# EAGLE design eeZeeProp (EAGLE 6.3)
DATABASE: ./../../../eagle/PARTSDB.txt
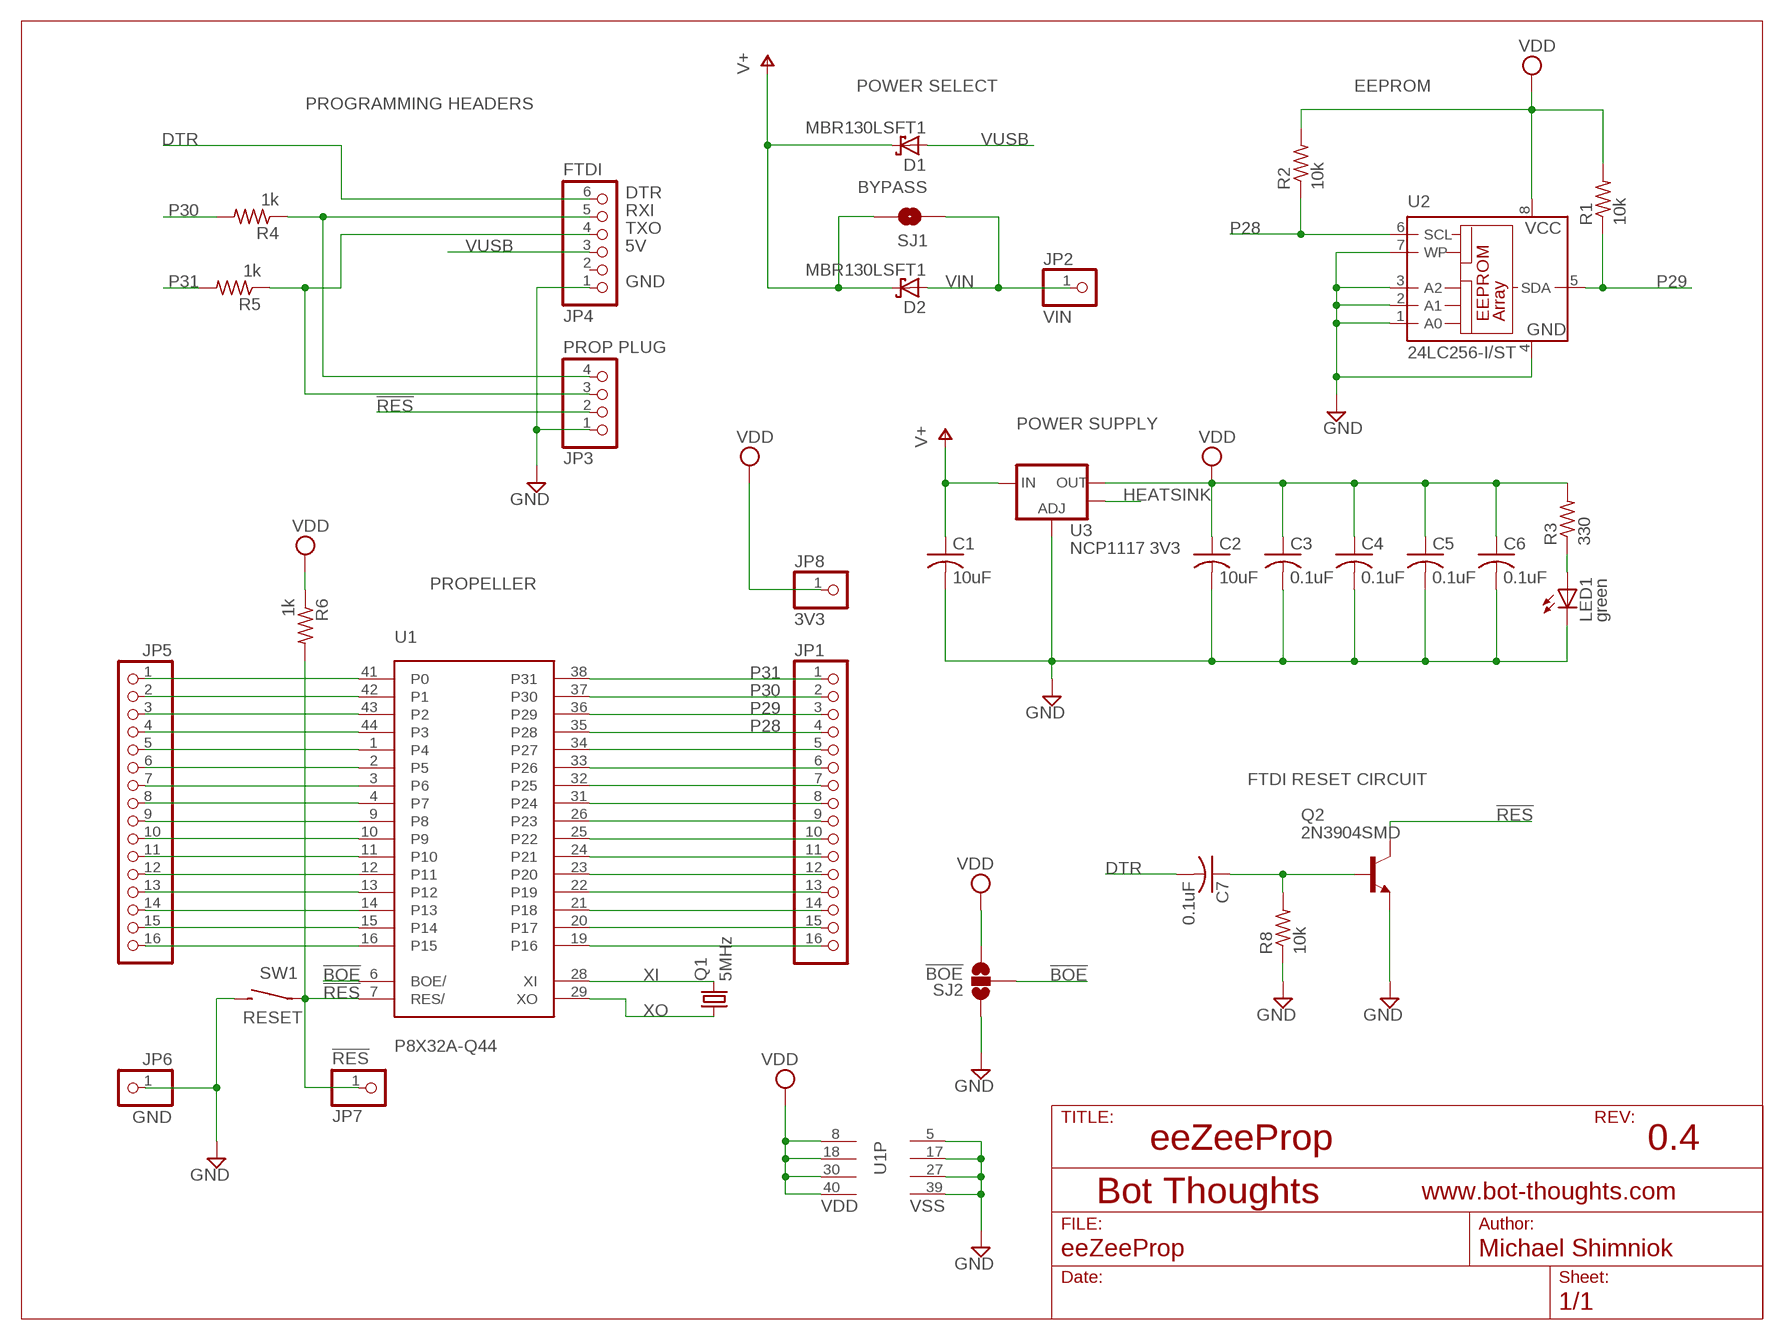
[diagram p0: schematic, sheet 1]

## Parts
C1  10uF  C-USC1206  [C1206]
C2  10uF  C-USC1206  [C1206]
C3  0.1uF  C-USC0603  [C0603]
C4  0.1uF  C-USC0603  [C0603]
C5  0.1uF  C-USC0603  [C0603]
C6  0.1uF  C-USC0603  [C0603]
C7  0.1uF  C-USC0603  [C0603]
D1  MBR130LSFT1  SCHOTTKY-DIODE-MBR130LSFT1  [SOD123FL]
D2  MBR130LSFT1  SCHOTTKY-DIODE-MBR130LSFT1  [SOD123FL]
JP1  PINHD-1X16_2.54-S  [1X16-S]
JP2  VIN  PINHD-1X01_2.54  [1X01]
JP3  PROP PLUG  PINHD-1X04_2.54-S  [1X04-S]
JP4  FTDI  PINHD-1X06_2.54-S  [1X06-S]
JP5  PINHD-1X16_2.54-S  [1X16-S]
JP6  GND  PINHD-1X01_2.54  [1X01]
JP7  !RES  PINHD-1X01_2.54  [1X01]
JP8  3V3  PINHD-1X01_2.54  [1X01]
LED1  green  LEDCHIPLED_1206  [CHIPLED_1206]
Q1  5MHz  CRYSTALHC49U-V  [HC49U-V]
Q2  2N3904SMD  [SOT-23]
R1  10k  R-US_R0603  [R0603]
R2  10k  R-US_R0603  [R0603]
R3  330  R-US_R0603  [R0603]
R4  1k  R-US_R0603  [R0603]
R5  1k  R-US_R0603  [R0603]
R6  1k  R-US_R0603  [R0603]
R8  10k  R-US_R0603  [R0603]
SJ1  BYPASS  SOLDERJUMPERNO  [SJ_2S-NO]
SJ2  !BOE  SOLDERJUMPER_2WAYS  [SJ_3]
SW1  RESET  SPST_TAC_RECT1  [6MMTACTILE_RECT]
U1  P8X32A-Q44  [P8X32A-Q44]
U2  24LC256-I/ST  24LC128SN  [SO-08]
U3  NCP1117 3V3  V_REG_LM1117SOT223  [SOT223]

## Nets
!BOE: SJ2.2 U1.6(BOE/)
!RES: JP3.2 JP7.1 Q2.1(C) R6.2 SW1.P$1(P) U1.7(RES/)
DTR: C7.2 JP4.6
GND: C1.2 C2.2 C3.2 C4.2 C5.2 C6.2 JP3.1 JP4.1 JP6.1 LED1.C Q2.2(E) R8.1 SJ2.1 SW1.P$2(S) U1.5(VSS) U1.17(VSS) U1.27(VSS) U1.39(VSS) U2.1(A0) U2.2(A1) U2.3(A2) U2.4(GND) U2.7(WP) U3.1(ADJ)
HEATSINK: U3.4(OUT)
N$1: JP5.1 U1.41(P0)
N$2: JP5.2 U1.42(P1)
N$3: JP5.3 U1.43(P2)
N$4: JP5.4 U1.44(P3)
N$5: LED1.A R3.1
N$6: JP5.5 U1.1(P4)
N$8: JP5.6 U1.2(P5)
N$9: JP5.7 U1.3(P6)
N$10: JP5.8 U1.4(P7)
N$11: JP5.9 U1.9(P8)
N$12: JP5.10 U1.10(P9)
N$13: JP5.11 U1.11(P10)
N$14: JP5.12 U1.12(P11)
N$15: JP5.13 U1.13(P12)
N$16: JP5.14 U1.14(P13)
N$17: JP5.15 U1.15(P14)
N$18: JP5.16 U1.16(P15)
N$19: JP1.5 U1.34(P27)
N$20: JP1.6 U1.33(P26)
N$21: JP1.7 U1.32(P25)
N$22: JP1.8 U1.31(P24)
N$23: JP1.9 U1.26(P23)
N$24: JP1.10 U1.25(P22)
N$25: JP1.11 U1.24(P21)
N$26: JP1.12 U1.23(P20)
N$27: JP1.13 U1.22(P19)
N$28: JP1.14 U1.21(P18)
N$29: JP1.15 U1.20(P17)
N$30: JP1.16 U1.19(P16)
N$31: C7.1 Q2.3(B) R8.2
N$34: JP3.4 JP4.5 R4.1
N$35: JP3.3 JP4.4 R5.1
P28: JP1.4 R2.1 U1.35(P28) U2.6(SCL)
P29: JP1.3 R1.1 U1.36(P29) U2.5(SDA)
P30: JP1.2 R4.2 U1.37(P30)
P31: JP1.1 R5.2 U1.38(P31)
V+: C1.1 D1.C D2.C SJ1.2 U3.3(IN)
VDD: C2.1 C3.1 C4.1 C5.1 C6.1 JP8.1 R1.2 R2.2 R3.2 R6.1 SJ2.3 U1.8(VDD) U1.18(VDD) U1.30(VDD) U1.40(VDD) U2.8(VCC) U3.2(OUT)
VIN: D2.A JP2.1 SJ1.1
VUSB: D1.A JP4.3
XI: Q1.2 U1.28(XI)
XO: Q1.1 U1.29(XO)
Unconnected: JP4.2

## Notes on the sheet
- POWER SELECT | EEPROM
- PROGRAMMING HEADERS
- DTR
- RXI
- TXO
- 5V
- GND
- POWER SUPPLY
- PROPELLER
- FTDI RESET CIRCUIT
- !BOE
- eeZeeProp | 0.4

## Library data of the parts
C1 C2 = rcl:C-US: CAPACITOR, American symbol; PARTNO: T491A106M006AT; SIZE: (0603); TC: X5R; TOL: 20%; TYPE: CER; VOLT: 10V
C3-C6 = rcl:C-US: CAPACITOR, American symbol; PARTNO: 0603YC104KAT2A; SIZE: (0603); TC: X5R; TOL: 20%; TYPE: CER; VOLT: 10V
C7 = rcl:C-US: CAPACITOR, American symbol; PARTNO: 0603YC104KAT2A
D1 D2 = mes_diode:SCHOTTKY-DIODE: DIODE transient-voltage suppressor; PARTNO: MBR130LSFT1G
JP1 JP5 = pinhead-2:PINHD-1X16: PIN HEADER
JP2 JP6-JP8 = pinhead-2:PINHD-1X01: PIN HEADER
JP3 = pinhead-2:PINHD-1X04: PIN HEADER
JP4 = pinhead-2:PINHD-1X06: PIN HEADER; PARTNO: 2211S-06G
LED1 = led:LED: LED OSRAM: - CHIPLED LG R971, LG N971, LY N971, LG Q971, LY Q971, LO R971, LY R971 LH N974, LH R974 LS Q976, LO Q976, LY Q976 LO Q996 - Hyper CHIPLED LW Q18S LB Q993, LB Q99A, LB R99A - SideLED LS A670, LO A670, LY A670, LG A670, LP A670 LB A673, LV A673, LT A673, LW A673 LH A674 LY A675 LS A676, LA A676, LO A676, LY A676, LW A676 LS A679, LY A679, LG A679 - Hyper Micro SIDELED® LS Y876, LA Y876, LO Y876, LY Y876 LT Y87S - SmartLED LW L88C, LW L88S LB L89C, LB L89S, LG L890 LS L89K, LO L89K, LY L89K LS L896, LA L896, LO L896, LY L896 - TOPLED LS T670, LO T670, LY T670, LG T670, LP T670 LSG T670, LSP T670, LSY T670, LOP T670, LYG T670 LG T671, LOG T671, LSG T671 LB T673, LV T673, LT T673, LW T673 LH T674 LS T676, LA T676, LO T676, LY T676, LB T676, LH T676, LSB T676, LW T676 LB T67C, LV T67C, LT T67C, LS T67K, LO T67K, LY T67K, LW E67C LS E67B, LA E67B, LO E67B, LY E67B, LB E67C, LV E67C, LT E67C LW T67C LS T679, LY T679, LG T679 LS T770, LO T770, LY T770, LG T770, LP T770 LB T773, LV T773, LT T773, LW T773 LH T774 LS E675, LA E675, LY E675, LS T675 LS T776, LA T776, LO T776, LY T776, LB T776 LHGB T686 LT T68C, LB T68C - Hyper Mini TOPLED® LB M676 - Mini TOPLED Santana® LG M470 LS M47K, LO M47K, LY M47K Source: http://www.osram.convergy.de LUXEON: - LUMILED® LXK2-PW12-R00, LXK2-PW12-S00, LXK2-PW14-U00, LXK2-PW14-V00 LXK2-PM12-R00, LXK2-PM12-S00, LXK2-PM14-U00 LXK2-PE12-Q00, LXK2-PE12-R00, LXK2-PE12-S00, LXK2-PE14-T00, LXK2-PE14-U00 LXK2-PB12-K00, LXK2-PB12-L00, LXK2-PB12-M00, LXK2-PB14-N00, LXK2-PB14-P00, LXK2-PB14-Q00 LXK2-PR12-L00, LXK2-PR12-M00, LXK2-PR14-Q00, LXK2-PR14-R00 LXK2-PD12-Q00, LXK2-PD12-R00, LXK2-PD12-S00 LXK2-PH12-R00, LXK2-PH12-S00 LXK2-PL12-P00, LXK2-PL12-Q00, LXK2-PL12-R00 Source: www.luxeon.com KINGBRIGHT: KA-3528ASYC Source: www.kingbright.com; PARTNO: LG N971-KN-1
Q1 = crystal:CRYSTAL: CRYSTAL; OC_FARNELL: 1666969; OC_NEWARK: unknown; PARTNO: HC49US-5.000MABJ-UB
Q2 = mes_transistors:2N3904: NPN Transistor Small signal NPN Bipolar Junction Transistor (BJT). Use this device to represent any of a number of such transistors with similar package and pinout: 2N4401, 2N3904, 2N2222, etc.; PARTNO: MMBT3904LT3G
R1 R2 R8 = rcl:R-US_: RESISTOR, American symbol; PARTNO: ERJ-3GEYJ103V; RATE: 100mW; SIZE: (0603); TOL: 5%
R3 = rcl:R-US_: RESISTOR, American symbol; PARTNO: ERJ-3GEYJ331V
R4-R6 = rcl:R-US_: RESISTOR, American symbol; PARTNO: RC0603JR-071KL; RATE: 100mW; SIZE: (0603); TOL: 5%
SJ1 = SparkFun:SOLDERJUMPER: Solder Jumper Standard SMD solder jumper. Used to automate production. Two varients : Normally Open and Normally Closed are the same, but have different paste layers. NC will have a large amount of paste and should jumper during reflow.
SJ2 = SparkFun:SOLDERJUMPER_2WAY: Solder Jumper 2 way solder jumper
SW1 = mes_electromech:SPST: SPST SWITCH; PARTNO: MJTP1243
U1 = parallax_propeller:P8X32A-Q44; PARTNO: P8X32A-Q44
U2 = microchip:24*: Serial EEPROM I2C; MF: OnSemi; MPN: CAT24C256WI-GT3; OC_FARNELL: 9757937; OC_NEWARK: 30H1511; PARTNO: CAT24C256WI-GT3
U3 = SparkFun:V_REG_LM1117: Voltage Regulator LM1117 Standard adjustable voltage regulator but in SMD form. Spark Fun Electronics SKU : COM-00595; PARTNO: NCP1117ST33T3G

## Board
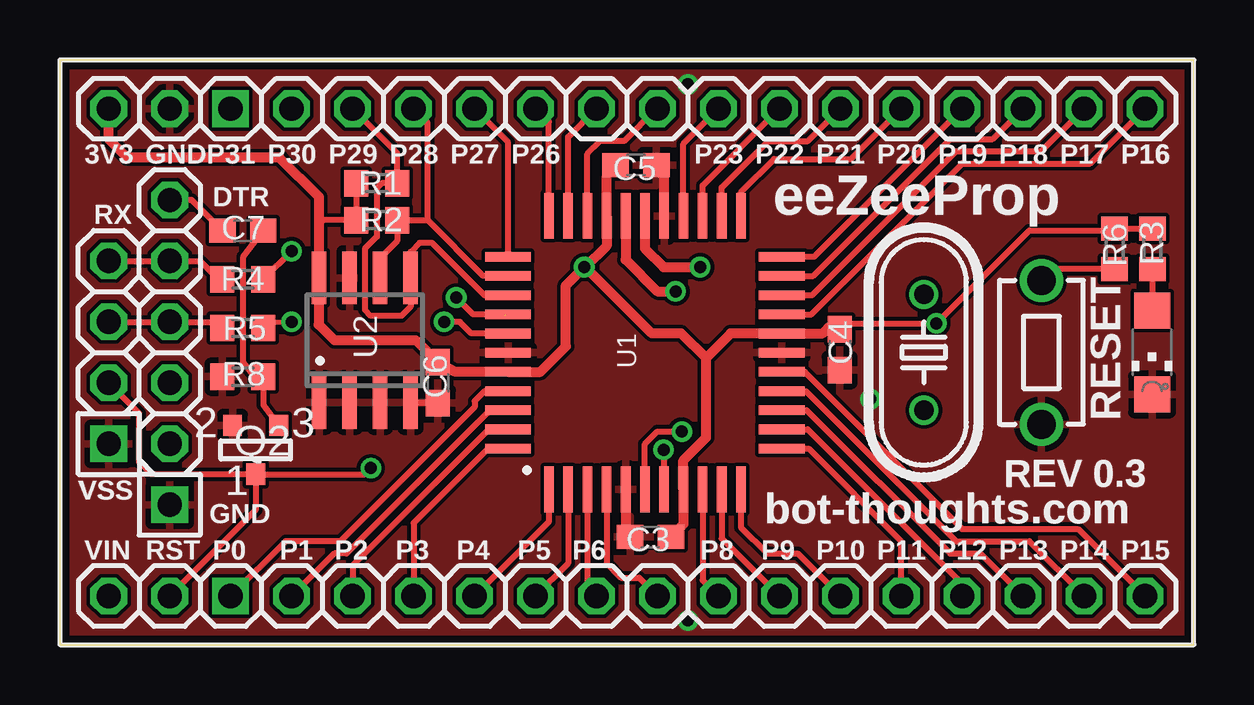
[diagram p1: board, top side]
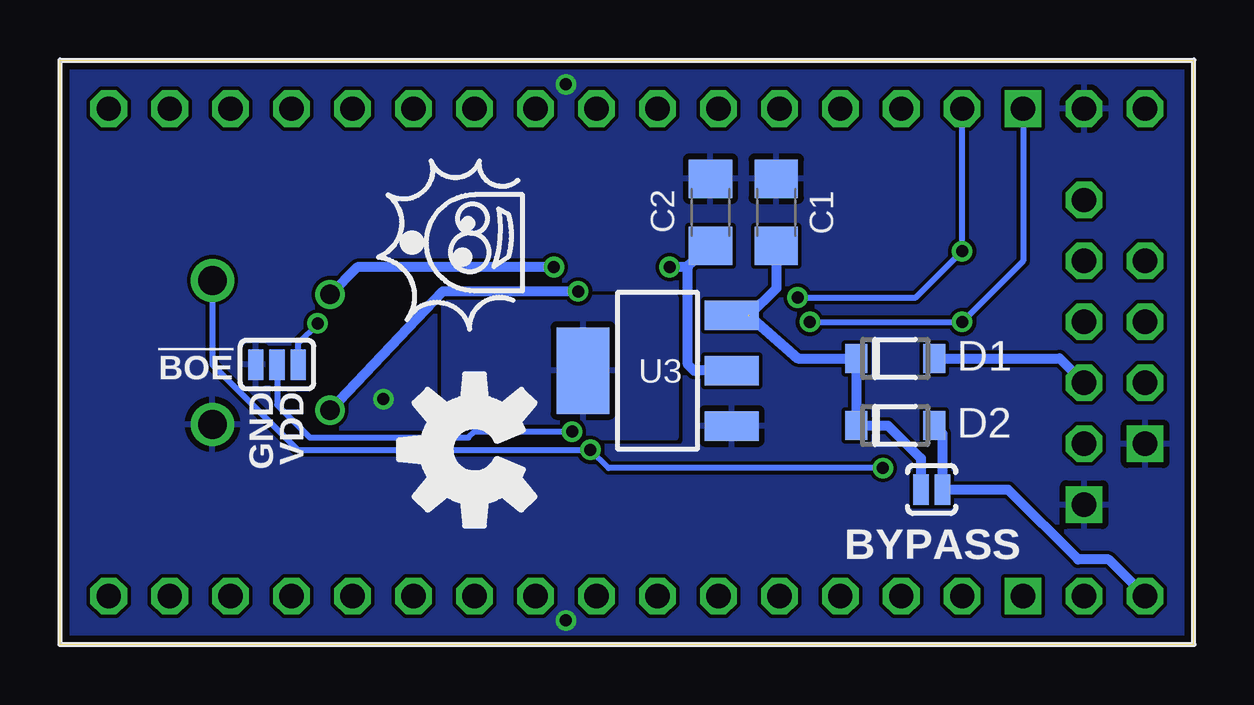
[diagram p2: board, bottom side, seen from below]

Size 47.24 x 24.38 mm. Coordinates in mm from the lower left corner, seen from the top.
Outline: 47.24,0 47.24,24.38 0,24.38 0,0 47.24,0
Copper layers (1*16): Top 0.0356mm / dielectric 1.5011mm / Bottom 0.0356mm
Design rules "default": minimum track width 6mil, minimum drill 13mil, track to track 6mil, track to pad 6mil, pad to pad 6mil, via to via 6mil, smd to smd 6mil, copper to edge 15mil, drill to drill 6mil, minimum pad ring 7mil, minimum via ring 7mil, stop-mask expansion 4mil, vias tented up to drill 20mil, thermal gap 10mil

### Footprints (pad centres in the part's own frame; a part is rotated, then mirrored left to right if it is on the bottom)
C1206 = smd 1.6 x 1.8: 1 -1.4,0; 2 1.4,0
C0603 = smd 1.1 x 1: 1 -0.85,0; 2 0.85,0
SOD123FL = smd 0.91 x 1.22: A 1.625,0; C -1.625,0
1X16-S = drill 1.016 square: 1 -19.05,0 | drill 1.016 octagon: 2 -16.51,0; 3 -13.97,0; 4 -11.43,0; 5 -8.89,0; 6 -6.35,0; 7 -3.81,0; 8 -1.27,0; 9 1.27,0; 10 3.81,0; 11 6.35,0; 12 8.89,0; 13 11.43,0; 14 13.97,0; 15 16.51,0; 16 19.05,0
1X01 = drill 1.016 octagon: 1 0,0
1X04-S = drill 1.016 square: 1 -3.81,0 | drill 1.016 octagon: 2 -1.27,0; 3 1.27,0; 4 3.81,0
1X06-S = drill 1.016 square: 1 -6.35,0 | drill 1.016 octagon: 2 -3.81,0; 3 -1.27,0; 4 1.27,0; 5 3.81,0; 6 6.35,0
CHIPLED_1206 = smd 1.5 x 1.5: A 0,-1.75; C 0,1.75
HC49U-V = drill 0.813: 1 -2.413,0; 2 2.413,0
SOT-23 = smd 0.787 x 0.889: 1 0.025,-1.016; 2 -0.94,1.016; 3 0.991,1.016
R0603 = smd 1 x 1.1: 1 -0.85,0; 2 0.85,0
SJ_2S-NO = smd 0.635 x 1.27: 1 -0.45,0; 2 0.45,0
SJ_3 = smd 0.635 x 1.27: 1 -0.889,0; 2 0,0; 3 0.889,0
6MMTACTILE_RECT = drill 1.2: P$1 -3,0; P$2 3,0
P8X32A-Q44 = smd 1.9 x 0.4: 1 -5.713,4.013; 2 -5.713,3.212; 3 -5.713,2.413; 4 -5.713,1.613; 5 -5.713,0.812; 6 -5.713,0.013; 7 -5.713,-0.787; 8 -5.713,-1.587; 9 -5.713,-2.388; 10 -5.713,-3.188; 11 -5.713,-3.987; 23 5.688,-3.987; 24 5.688,-3.188; 25 5.688,-2.388; 26 5.688,-1.587; 27 5.688,-0.787; 28 5.688,0.013; 29 5.688,0.812; 30 5.688,1.613; 31 5.688,2.413; 32 5.688,3.212; 33 5.688,4.013 | smd 0.4 x 1.9: 12 -4.013,-5.688; 13 -3.212,-5.688; 14 -2.413,-5.688; 15 -1.613,-5.688; 16 -0.812,-5.688; 17 -0.013,-5.688; 18 0.787,-5.688; 19 1.587,-5.688; 20 2.388,-5.688; 21 3.188,-5.688; 22 3.987,-5.688; 34 3.987,5.713; 35 3.188,5.713; 36 2.388,5.713; 37 1.587,5.713; 38 0.787,5.713; 39 -0.013,5.713; 40 -0.812,5.713; 41 -1.613,5.713; 42 -2.413,5.713; 43 -3.212,5.713; 44 -4.013,5.713
SO-08 = smd 0.6 x 2.2: 1 -1.905,-2.6; 2 -0.635,-2.6; 3 0.635,-2.6; 4 1.905,-2.6; 5 1.905,2.6; 6 0.635,2.6; 7 -0.635,2.6; 8 -1.905,2.6
SOT223 = smd 1.219 x 2.235: 1 -2.311,-3.099; 2 0,-3.099; 3 2.311,-3.099 | smd 3.6 x 2.2: 4 0,3.099

### Placement (x,y rotation side)
C1  17.4,18.03 90 bottom
C2  20.14,18.03 90 bottom
C3  24.6,4.5 180 top
C4  32.49,12.3 270 top
C5  24,20 0 top
C6  15.75,10.92 270 top
C7  7.62,17.27 180 top
D1  12.45,11.94 0 bottom
D2  12.45,9.14 0 bottom
JP1  26.16,22.35 0 top
JP2  2.03,2.03 0 top
JP3  2.03,12.19 90 top
JP4  4.57,12.19 90 top
JP5  26.16,2.03 0 top
JP6  4.57,22.35 0 top
JP7  4.57,2.03 0 top
JP8  2.03,22.35 0 top
LED1  45.5,12.19 180 top
Q1  35.99,12.19 90 top
Q2  8.13,8.13 0 top
R1  13.2,19.25 180 top
R2  13.2,17.7 180 top
R3  45.52,16.51 90 top
R4  7.62,15.24 0 top
R5  7.62,13.21 0 top
R6  43.94,16.51 270 top
R8  7.62,11.18 0 top
SJ1  10.92,6.48 180 bottom
SJ2  38.2,11.68 0 bottom
SW1  40.89,12.19 270 top
U1  24.38,12.19 90 top
U2  12.7,12.7 0 top
U3  22.35,11.43 90 bottom

### Tracks (layer width: path | path; a pad name or v marks a point on that pad's centre or on a via)
!BOE  (via drill 0.5)
  Top 0.254: U1.6 24.37,8.37 24.89,8.89 v25.91,8.89
  Bottom 0.254: SJ2.2 38.2,10.01 36.83,8.64 30.23,8.64 29.97,8.89 v25.91,8.89
!RES  (via drill 0.5)
  Top 0.254: R6.2 41.36,15.66 SW1.P$1 | Q2.1 8.15,5.61 JP7.1 | Q2.1 3.81,7.11 3.3,7.62 3.3,9.65 JP3.2 | Q2.1 12.7,7.11 v12.95,7.37 | v25.15,8.13 25.15,6.5 U1.7
  Bottom 0.254: v12.95,7.37 24.38,7.37 v25.15,8.13 37.34,8.13 40.89,11.68 SW1.P$1
DTR
  Top 0.254: C7.2 6.76,17.27 5.49,18.54 JP4.6
GND  (via drill 0.5)
  Top 0.254: 25.17,19.68 C5.2 | C6.2 14.64,10.07 14.48,10.16
  Top 0.406: U1.5 23.57,4.68 C3.2 | U1.27 25.17,19.53 24.89,19.81
  other vias: 26.16,23.37 26.16,1.02 33.77,10.24
  pour Bottom (rank 3): 0,24.13 47.24,24.13 47.24,0.25 0,0.25
  pour Top (rank 5): 0.25,24.13 46.99,24.13 46.99,0.25 0.25,0.25
HEATSINK
  pour Bottom: 21.59,14.48 21.59,8.64 31.24,8.64 31.24,14.48
N$1
  Top 0.254: U1.41 17.69,10.58 17.27,10.16 17.27,9.91 11.68,4.32 9.4,4.32 JP5.1
N$2
  Top 0.254: U1.42 17.91,9.78 11.94,3.81 11.43,3.81 JP5.2
N$3
  Top 0.254: U1.43 17.87,8.98 12.19,3.3 JP5.3
N$4
  Top 0.254: JP5.4 14.73,5.08 17.91,8.26 U1.44
N$5
  Top 0.254: R3.1 LED1.A
N$6
  Top 0.254: U1.1 20.37,5.13 JP5.5
N$8
  Top 0.254: U1.2 21.17,3.39 JP5.6
N$9
  Top 0.254: U1.3 21.97,2.41 JP5.7
N$10
  Top 0.254: U1.4 22.77,3.39 23.37,2.79 24.13,2.79 JP5.8
N$11
  Top 0.254: U1.9 26.77,2.69 JP5.9
N$12
  Top 0.254: U1.10 27.57,4.43 JP5.10
N$13
  Top 0.254: U1.11 28.37,4.9 29.46,3.81 30.73,3.81 JP5.11
N$14
  Top 0.254: U1.12 31.19,8.18 35.05,4.32 JP5.12
N$15
  Top 0.254: U1.13 31.15,8.98 37.59,2.54 JP5.13
N$16
  Top 0.254: U1.14 31.11,9.78 37.08,3.81 38.35,3.81 JP5.14
N$17
  Top 0.254: U1.15 31.08,10.58 37.34,4.32 40.39,4.32 JP5.15
N$18
  Top 0.254: U1.16 31.04,11.38 37.59,4.83 42.42,4.83 JP5.16
N$19
  Top 0.254: U1.34 18.67,20.95 JP1.5
N$20
  Top 0.254: U1.33 20.37,21.79 JP1.6
N$21
  Top 0.254: U1.32 21.17,21.17 JP1.7
N$22
  Top 0.254: U1.31 21.97,20.47 22.5,21 23.5,21 24.85,22.35 JP1.8
N$23
  Top 0.254: U1.26 25.97,20.89 JP1.9
N$24
  Top 0.254: U1.25 26.77,19.15 JP1.10
N$25
  Top 0.254: U1.24 27.57,19.07 29.5,21 31.16,21 JP1.11
N$26
  Top 0.254: U1.23 28.37,18.87 29.75,20.25 32.95,20.25 JP1.12
N$27
  Top 0.254: U1.22 31.42,16.18 JP1.13
N$28
  Top 0.254: U1.21 31.38,15.38 37.08,21.08 38.86,21.08 JP1.14
N$29
  Top 0.254: U1.20 31.34,14.58 37.34,20.57 40.89,20.57 JP1.15
N$30
  Top 0.254: U1.19 31.3,13.78 37.59,20.07 42.93,20.07 JP1.16
N$31
  Top 0.254: C7.1 7.64,16.19 7.64,11.76 8.47,10.73 R8.2 8.47,10 Q2.3
N$34
  Top 0.254: JP3.4 JP4.5 5.84,16 6.35,15.49 R4.1
N$35
  Top 0.254: JP3.3 JP4.4 6.35,13.46 R5.1
P28
  Top 0.254: 15.32,17.7 R2.1 14.04,16.84 13.34,16.13 U2.6 | U1.35 17.64,15.38 15.32,17.7 | 15.32,17.7 15.32,21.77 JP1.4
P29
  Top 0.254: U1.36 17.68,14.58 15.49,16.76 14.99,16.76 14.61,16.38 U2.5 14.61,14.1 14.22,13.72 12.95,13.72 12.7,13.97 12.7,16.51 13.21,17.02 13.21,19.05 13.4,19.25 R1.1 14.04,20.5 JP1.3
P30  (via drill 0.5 pad 0.41)
  Top 0.254: U1.37 17.21,13.78 v16.51,14.48 | v9.65,16.41 R4.2
  Bottom 0.254: v16.51,14.48 11.58,14.48 v9.65,16.41 JP1.2
P31  (via drill 0.5 pad 0.41)
  Top 0.203: R5.2 8.72,13.45 v9.65,13.46
  Top 0.254: U1.38 17.14,12.98 16.66,13.46 v16,13.46
  Bottom 0.254: v16,13.46 v9.65,13.46 7.11,16 JP1.1
V+  (1 unrouted)
  Bottom 0.406: U3.3 18.57,13.74 16.51,11.94 D1.C D2.C 12.75,9.14 11.38,7.77 SJ1.2 | C1.1 17.4,14.86 18.54,13.72
VDD  (via drill 0.5)
  Top 0.254: C4.1 32.54,13.4 v36.51,13.4 40.39,17.27 43.85,17.27 R6.1 R3.2 | 22.77,19.48 23.1,19.81 23.1,19.95 C5.1 | R1.2 R2.2 10.97,17.7 10.79,17.53
  Top 0.406: 45.49,17.27 R3.2 | JP8.1 2.03,21.08 2.79,20.32 9.14,20.32 10.79,18.67 10.79,17.53 U2.8 10.78,13.35 11.43,12.7 14.82,12.7 C6.1 16.47,11.38 U1.40 20.02,11.38 21.08,12.45 21.08,14.99 v21.84,15.75 21.89,15.75 | C3.1 25.97,5.02 U1.8 25.97,7.68 26.92,8.64 26.92,11.96 | C4.1 32.43,13.21 32,13.21 31.78,12.98 U1.18 27.94,12.98 26.92,11.96 | 22.77,19.48 U1.30 22.77,16.62 21.89,15.75 | 26.92,11.96 25.91,12.95 25.88,12.98 24.66,12.98 21.89,15.75
  Bottom 0.254: v36.51,13.4 36.51,13.37 37.31,12.57 SJ2.3
  Bottom 0.406: U3.2 20.83,11.43 21.08,11.68 21.08,15.75 | 21.08,15.75 21.08,15.8 C2.1 | 21.08,15.75 v21.84,15.75
VIN
  Bottom 0.406: JP2.1 3.56,3.56 4.83,3.56 7.75,6.48 SJ1.1 10.47,8.79 D2.A
VUSB
  Bottom 0.406: D1.A 5.59,11.94 JP4.3
XI  (via drill 0.5)
  Top 0.406: U1.28 24.37,16.52 25.15,15.75 v26.67,15.75
  Bottom 0.406: v26.67,15.75 34.85,15.75 Q1.2
XO  (via drill 0.5)
  Top 0.406: U1.29 23.57,16.05 24.89,14.73 v25.65,14.73
  Bottom 0.406: v25.65,14.73 31.29,14.73 Q1.1

### Text on the board
tPlace: 3V3 | GND | P31 | P30 | P29 | P28 | P27 | P26 | P23 | P22 | P21 | P20 | P19 | P18 | P17 | P16 | RX | DTR | eeZeeProp | VSS | REV 0.3 | GND | bot-thoughts.com | VIN | RST | P0 | P1 | P2 | P3 | P4 | P5 | P6 | P8 | P9 | P10 | P11 | P12 | P13 | P14 | P15
tNames: P16
bNames: VDD | GND
_tsilk: 3V3 | GND | P31 | P30 | P29 | P28 | P27 | P26 | P23 | P22 | P21 | P20 | P19 | P18 | P17 | P16 | P16 | RX | DTR | eeZeeProp | RESET | VSS | REV 0.3 | GND | bot-thoughts.com | VIN | RST | P0 | P1 | P2 | P3 | P4 | P5 | P6 | P8 | P9 | P10 | P11 | P12 | P13 | P14 | P15
_bsilk: !BOE | !BOE | VDD | GND | BYPASS